# EAGLE design ArduinoShieldAdaptor-0BAC0805 (EAGLE 5.10)
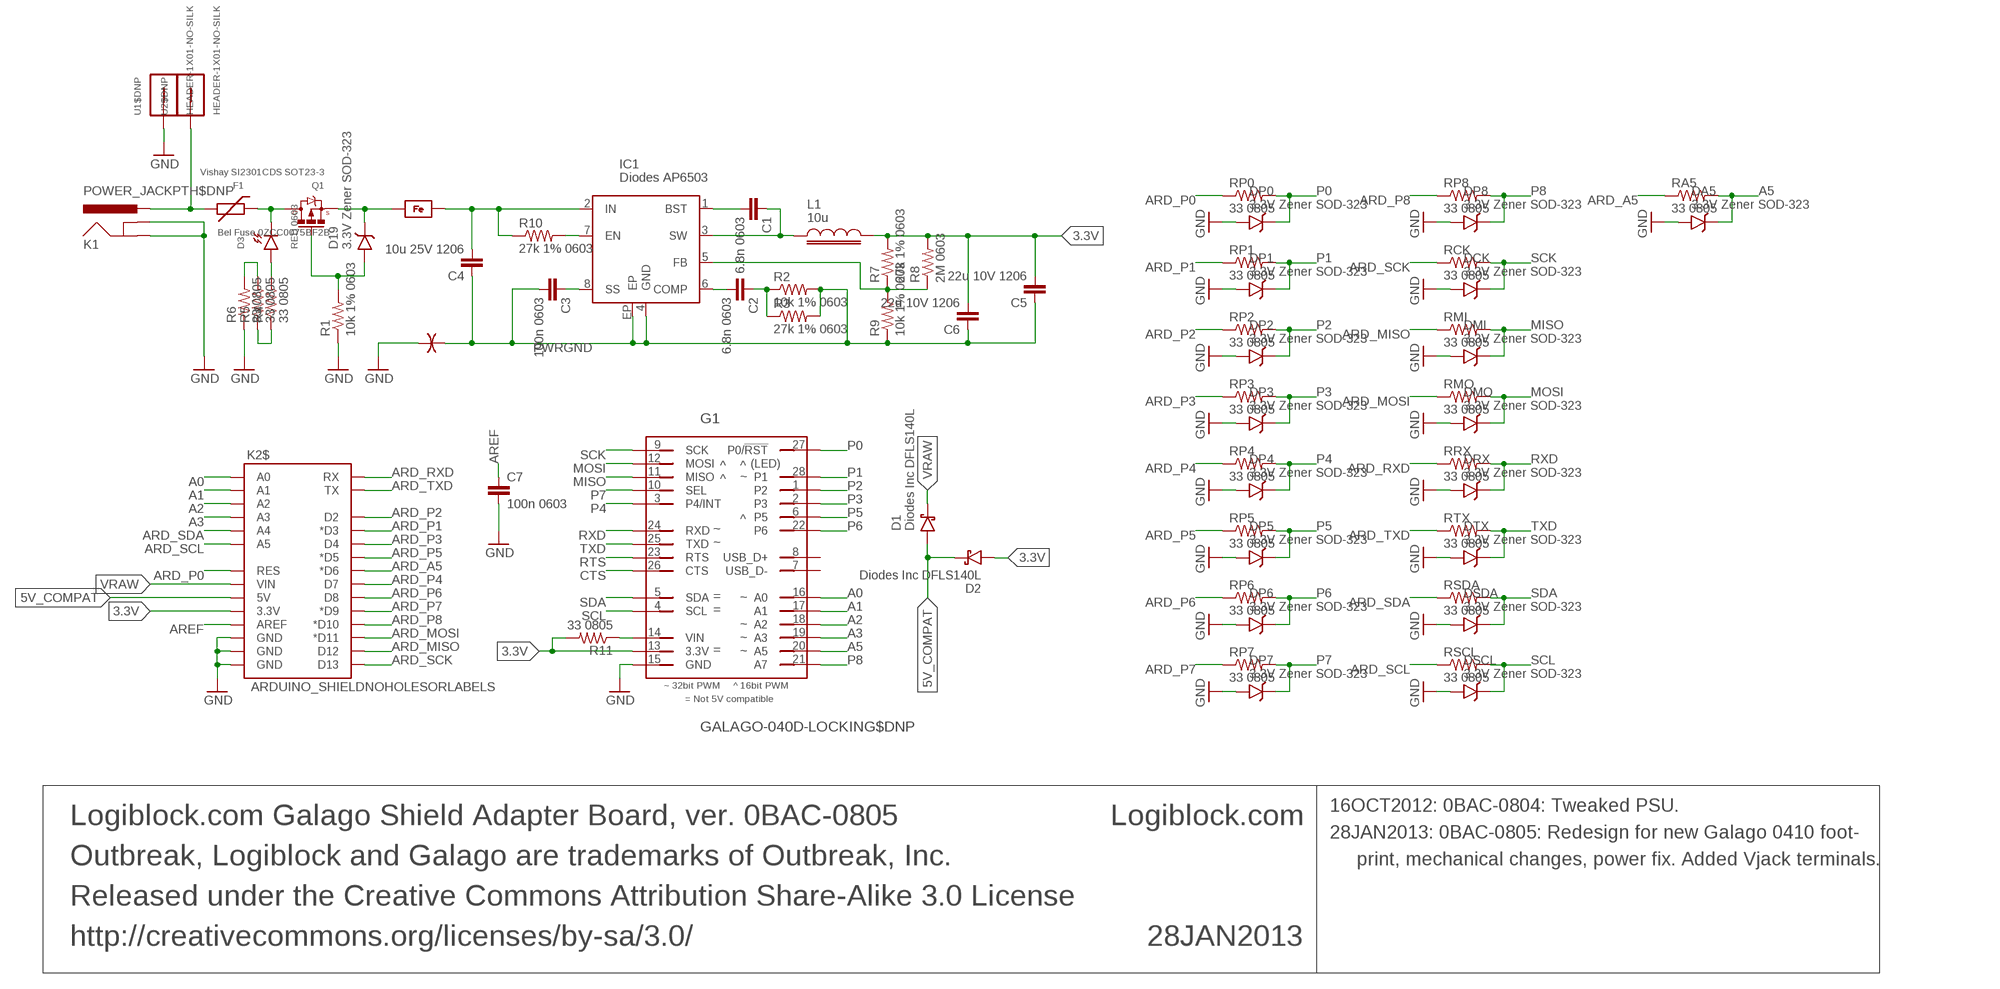
[diagram p0: schematic, sheet 1]

## Parts
28JAN2013  Logiblock.com Galago Shield Adapter Board, ver. 0BAC-0805  INFO-BLOCK  [INFO-BLOCK]
C1  6.8n 0603  CAP-0603  [0603]
C2  6.8n 0603  CAP-0603  [0603]
C3  100n 0603  CAP-0603  [0603]
C4  10u 25V 1206  CAP-1206  [1206]
C5  22u 10V 1206  CAP-1206  [1206]
C6  22u 10V 1206  CAP-1206  [1206]
C7  100n 0603  CAP-0603  [0603]
D1  Diodes Inc DFLS140L  DIODE-SCHOTTKY-POWERDI-123  [DIODE-SMT-POWERDI-123]
D2  Diodes Inc DFLS140L  DIODE-SCHOTTKY-POWERDI-123  [DIODE-SMT-POWERDI-123]
D3  RED 0603  LED-0603  [0603-DIODE]
D19  3.3V Zener SOD-323  DIODE-ZENER-SOD323  [SOD323]
DA5  3.3V Zener SOD-323  DIODE-ZENER-SOD323  [SOD323]
DCK  3.3V Zener SOD-323  DIODE-ZENER-SOD323  [SOD323]
DMI  3.3V Zener SOD-323  DIODE-ZENER-SOD323  [SOD323]
DMO  3.3V Zener SOD-323  DIODE-ZENER-SOD323  [SOD323]
DP0  3.3V Zener SOD-323  DIODE-ZENER-SOD323  [SOD323]
DP1  3.3V Zener SOD-323  DIODE-ZENER-SOD323  [SOD323]
DP2  3.3V Zener SOD-323  DIODE-ZENER-SOD323  [SOD323]
DP3  3.3V Zener SOD-323  DIODE-ZENER-SOD323  [SOD323]
DP4  3.3V Zener SOD-323  DIODE-ZENER-SOD323  [SOD323]
DP5  3.3V Zener SOD-323  DIODE-ZENER-SOD323  [SOD323]
DP6  3.3V Zener SOD-323  DIODE-ZENER-SOD323  [SOD323]
DP7  3.3V Zener SOD-323  DIODE-ZENER-SOD323  [SOD323]
DP8  3.3V Zener SOD-323  DIODE-ZENER-SOD323  [SOD323]
DRX  3.3V Zener SOD-323  DIODE-ZENER-SOD323  [SOD323]
DSCL  3.3V Zener SOD-323  DIODE-ZENER-SOD323  [SOD323]
DSDA  3.3V Zener SOD-323  DIODE-ZENER-SOD323  [SOD323]
DTX  3.3V Zener SOD-323  DIODE-ZENER-SOD323  [SOD323]
F1  Bel Fuse 0ZCC0075BF2B  PTC-1812-(4532-METRIC)  [1812-(4532-METRIC)-PTC]
FB1  3A 100@100MHz 0603  FERRITE-BEAD-0603  [0603]
G1  GALAGO-040D-LOCKING$DNP  GALAGO-040D-LOCKING  [GALAGO-LOCKING]
IC1  Diodes AP6503  SWITCHING-REGULATOR-VARIABLE-BUCK-DIODES-AP6503  [EIAJ-SOIC8-3.9MM-EXPOSED-PAD]
K1  POWER_JACKPTH$DNP  POWER_JACKPTH  [POWER_JACK_PTH]
K2$  ARDUINO_SHIELDNOHOLESORLABELS  [DUEMILANOVE_SHIELD_NOHOLES_NOLABELS]
L1  10u  INDUCTOR-6X6MM  [INDUCTOR-SMD-6X6MM]
Q1  Vishay SI2301CDS SOT23-3  MOSFET-P-CHANNEL-VISHAY-SI2301  [SOT23-3]
R1  10k 1% 0603  RESISTOR-0603  [0603]
R2  10k 1% 0603  RESISTOR-0603  [0603]
R3  27k 1% 0603  RESISTOR-0603  [0603]
R4  33 0805  RESISTOR-0805  [0805]
R5  33 0805  RESISTOR-0805  [0805]
R6  33 0805  RESISTOR-0805  [0805]
R7  27k 1% 0603  RESISTOR-0603  [0603]
R8  2M 0603  RESISTOR-0603  [0603]
R9  10k 1% 0603  RESISTOR-0603  [0603]
R10  27k 1% 0603  RESISTOR-0603  [0603]
R11  33 0805  RESISTOR-0805  [0805]
RA5  33 0805  RESISTOR-0805  [0805]
RCK  33 0805  RESISTOR-0805  [0805]
RMI  33 0805  RESISTOR-0805  [0805]
RMO  33 0805  RESISTOR-0805  [0805]
RP0  33 0805  RESISTOR-0805  [0805]
RP1  33 0805  RESISTOR-0805  [0805]
RP2  33 0805  RESISTOR-0805  [0805]
RP3  33 0805  RESISTOR-0805  [0805]
RP4  33 0805  RESISTOR-0805  [0805]
RP5  33 0805  RESISTOR-0805  [0805]
RP6  33 0805  RESISTOR-0805  [0805]
RP7  33 0805  RESISTOR-0805  [0805]
RP8  33 0805  RESISTOR-0805  [0805]
RRX  33 0805  RESISTOR-0805  [0805]
RSCL  33 0805  RESISTOR-0805  [0805]
RSDA  33 0805  RESISTOR-0805  [0805]
RTX  33 0805  RESISTOR-0805  [0805]
U1$  GND-ISOLATOR-0.032"  [GND-ISOLATOR-0.032"]
U1$DNP  HEADER-1X01-NO-SILK  [HEADER-1X01-NO-SILK]
U2$DNP  HEADER-1X01-NO-SILK  [HEADER-1X01-NO-SILK]

## Nets
3.3V: C5.1 C6.1 D2.SMALL(A) G1.13(3.3V) K2$.3.3V L1.2 R7.2 R8.2 R11.2
5V_COMPAT: D1.SMALL(A) D2.BIG(K) K2$.5V
A0: G1.16(A0) K2$.A0
A1: G1.17(A1) K2$.A1
A2: G1.18(A2) K2$.A2
A3: G1.19(A3) K2$.A3
A5: DA5.K G1.20(A5) RA5.2
ARD_A5: K2$.D6(*D6) RA5.1
ARD_MISO: K2$.D12 RMI.1
ARD_MOSI: K2$.D11(*D11) RMO.1
ARD_P0: K2$.RES RP0.1
ARD_P1: K2$.D3(*D3) RP1.1
ARD_P2: K2$.D2 RP2.1
ARD_P3: K2$.D4 RP3.1
ARD_P4: K2$.D7 RP4.1
ARD_P5: K2$.D5(*D5) RP5.1
ARD_P6: K2$.D8 RP6.1
ARD_P7: K2$.D9(*D9) RP7.1
ARD_P8: K2$.D10(*D10) RP8.1
ARD_RXD: K2$.RX RRX.1
ARD_SCK: K2$.D13 RCK.1
ARD_SCL: K2$.A5 RSCL.1
ARD_SDA: K2$.A4 RSDA.1
ARD_TXD: K2$.TX RTX.1
AREF: C7.2 K2$.AREF
CTS: G1.26(CTS)
GND: C7.1 DA5.A DCK.A DMI.A DMO.A DP0.A DP1.A DP2.A DP3.A DP4.A DP5.A DP6.A DP7.A DP8.A DRX.A DSCL.A DSDA.A DTX.A G1.15(GND) K1.GND K1.GNDBREAK K2$.GND@0(GND) K2$.GND@1(GND) K2$.GND@2(GND) R1.1 R6.1 U1$.A U1$DNP.1
MISO: DMI.K G1.11(MISO) RMI.2
MOSI: DMO.K G1.12(MOSI) RMO.2
N$1: IC1.7(EN) R10.2
N$2: IC1.5(FB) R7.1 R8.1 R9.2
N$4: C2.2 R2.1 R3.1
N$5: C2.1 IC1.6(COMP)
N$6: C1.1 IC1.1(BST)
N$7: C1.2 IC1.3(SW) L1.1
N$8: D19.A Q1.1(GATE) R1.2
N$12: C3.2 IC1.8(SS)
N$13: D3.1(A) R4.2
N$20: R4.1 R5.1
N$21: R5.2 R6.2
N$22: G1.14(VIN) R11.1
P0: DP0.K G1.27(P0/!RST) RP0.2
P1: DP1.K G1.28(P1) RP1.2
P2: DP2.K G1.1(P2) RP2.2
P3: DP3.K G1.2(P3) RP3.2
P4: DP4.K G1.3(P4/INT) RP4.2
P5: DP5.K G1.6(P5) RP5.2
P6: DP6.K G1.22(P6) RP6.2
P7: DP7.K G1.10(SEL) RP7.2
P8: DP8.K G1.21(A7) RP8.2
PWRGND: C3.1 C4.2 C5.2 C6.2 IC1.4(GND) IC1.EP R2.2 R3.2 R9.1 U1$.B
RTS: G1.23(RTS)
RXD: DRX.K G1.24(RXD) RRX.2
SCK: DCK.K G1.9(SCK) RCK.2
SCL: DSCL.K G1.4(SCL) RSCL.2
SDA: DSDA.K G1.5(SDA) RSDA.2
TXD: DTX.K G1.25(TXD) RTX.2
VIN: C4.1 FB1.2 IC1.2(IN) R10.1
VJACK: F1.1 K1.PWR U2$DNP.1
VJACK-FUSED: D3.2(K) F1.2 Q1.3(DRAIN)
VRAW: D1.BIG(K) D19.K FB1.1 K2$.VIN Q1.2(SOURCE)
Unconnected: G1.7(USB_D-) G1.8(USB_D+)

## Notes on the sheet
- 16OCT2012: 0BAC-0804: Tweaked PSU.
- 28JAN2013: 0BAC-0805: Redesign for new Galago 0410 foot-
- print, mechanical changes, power fix. Added Vjack terminals.

## Library data of the parts
28JAN2013 = Outbreak:INFO-BLOCK
C1-C7 = Outbreak:CAP
D1 D2 = Outbreak:DIODE-SCHOTTKY
D3 = Outbreak:LED
D19 DA5 DCK DMI DMO DP0 DP1-DP8 DRX DSCL DSDA DTX = Outbreak:DIODE-ZENER
F1 = Outbreak:PTC
FB1 = Outbreak:FERRITE-BEAD
G1 = Outbreak-v0:GALAGO-040D
IC1 = Outbreak:SWITCHING-REGULATOR-VARIABLE-BUCK-DIODES-AP6503
K1 = Outbreak:POWER_JACK: Power Jack This is the standard 5.5mm barrel jack for power. The PTH is the most common, proven, reliable, footprint. All others are experimental. The Slot footprint only works if the mill layer is transmitted to the PCB fab house so be warned. Spark Fun Electronics SKU : PRT-00119. Mating wall wart : TOL-00298 (and others)
K2$ = SparkFun:ARDUINO_SHIELD
L1 = Outbreak:INDUCTOR
Q1 = Outbreak:MOSFET-P-CHANNEL
R1-R11 RA5 RCK RMI RMO RP0 RP1-RP8 RRX RSCL RSDA RTX = Outbreak:RESISTOR: Resistor Basic schematic elements and footprints for 0603, 1206, and PTH resistors.
U1$ = Outbreak:GND-ISOLATOR
U1$DNP U2$DNP = Outbreak:HEADER-1X01

## Board
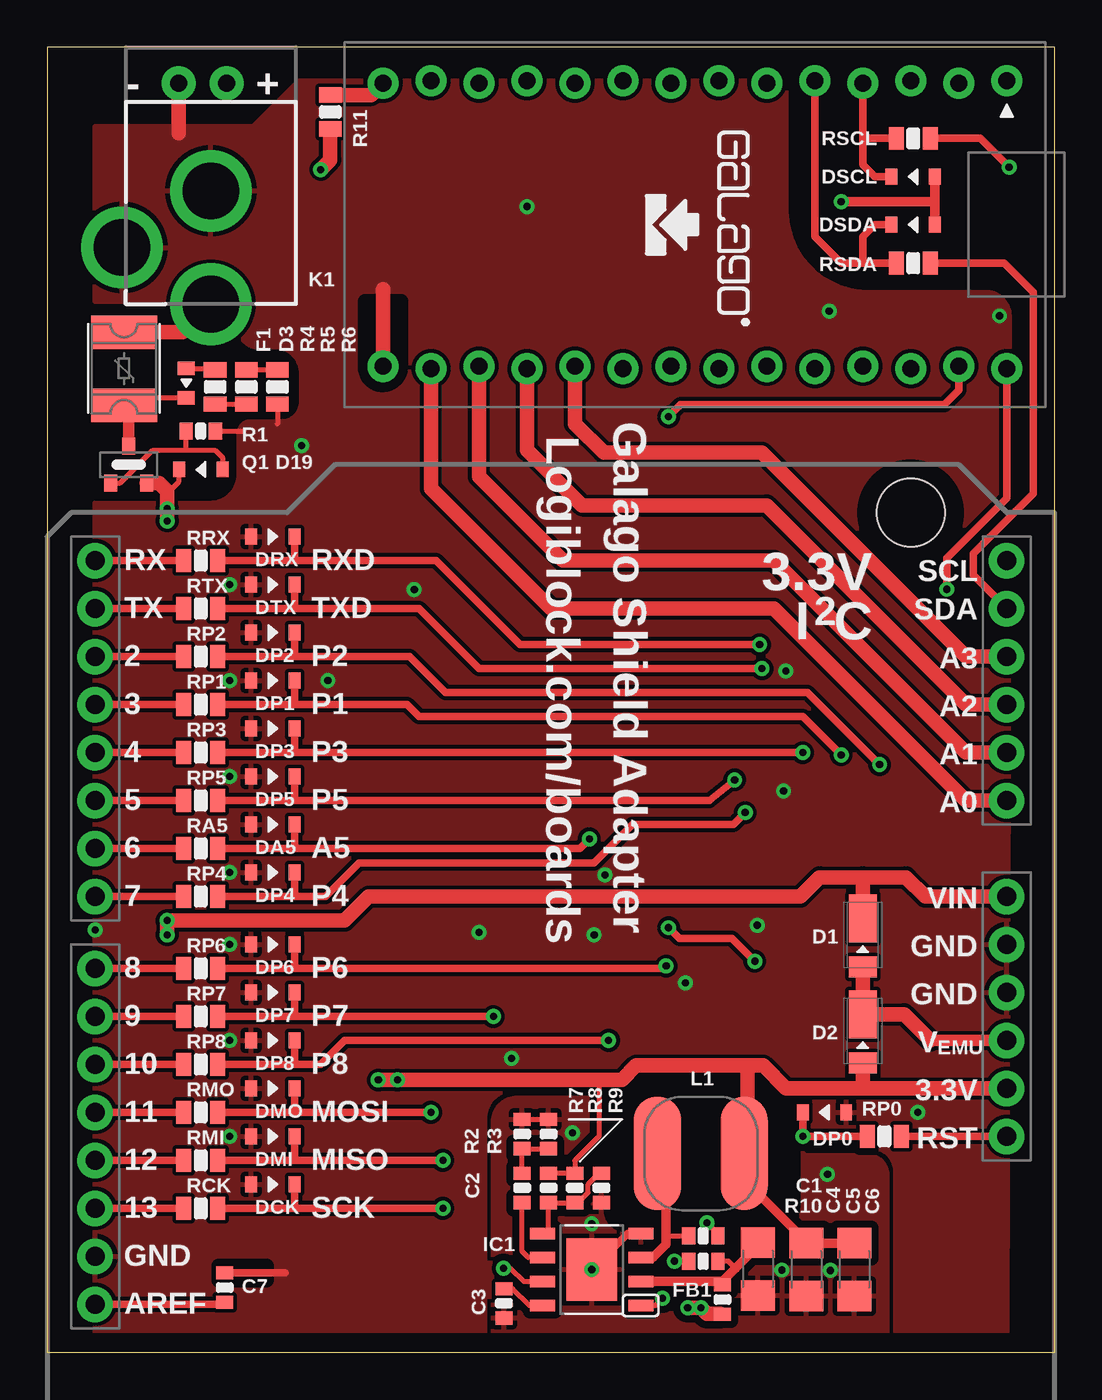
[diagram p1: board, top side]
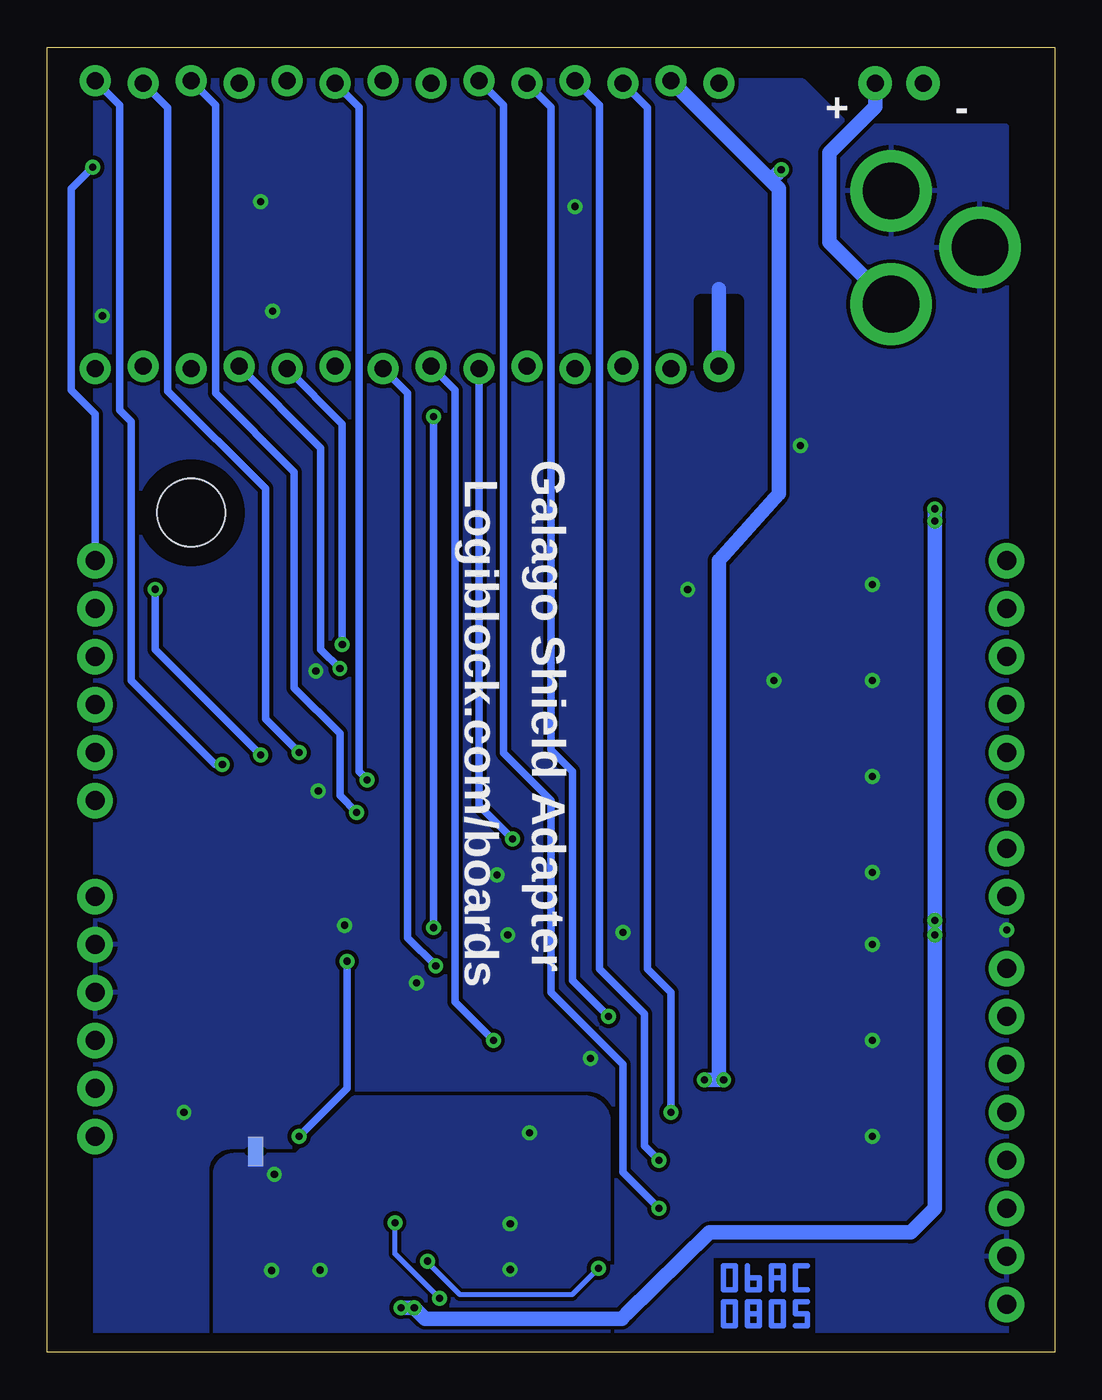
[diagram p2: board, bottom side, seen from below]

Size 53.34 x 69.09 mm. Coordinates in mm from the lower left corner, seen from the top.
Outline: 0,0 53.34,0 53.34,69.09 0,69.09 0,0
Copper layers (1*16): Top 0.035mm / dielectric 1.5mm / Bottom 0.035mm
Design rules "default *": minimum track width 10mil, minimum drill 15mil, track to track 8mil, track to pad 8mil, pad to pad 8mil, via to via 8mil, smd to smd 8mil, copper to edge 40mil, drill to drill 8mil, minimum pad ring 10mil, minimum via ring 8mil, stop-mask expansion 4mil, vias tented up to drill 20mil, thermal gap 10mil
Holes 3.61 mm at 45.72,44.45
tRestrict: area 30,6.9 to 39.4,13.5; area 9.1,3.8 to 11.6,4.6; area 16.8,51.2 to 18.7,55.7
bRestrict: area 16.8,51.2 to 18.7,55.7

### Footprints (pad centres in the part's own frame; a part is rotated, then mirrored left to right if it is on the bottom)
0603 = smd 0.7 x 0.9: 1 -0.777,0; 2 0.777,0
1206 = smd 1.6 x 1.8: 1 -1.4,0; 2 1.4,0
DIODE-SMT-POWERDI-123 = smd 2.52 x 1.5: BIG 0.87,0 | smd 1.1 x 1.5: SMALL -1.69,0
0603-DIODE = smd 0.7 x 0.9: 1 -0.777,0; 2 0.777,0
SOD323 = smd 0.63 x 0.83: A -1.15,0; K 1.15,0
1812-(4532-METRIC)-PTC = smd 1.78 x 3.5: 1 -1.922,0.002; 2 1.938,0.002
GALAGO-LOCKING = drill 0.9 pad 1.651 round: 1 -7.62,16.51; 2 -7.493,13.97; 3 -7.62,11.43; 4 -7.493,8.89; 5 -7.62,6.35; 6 -7.493,3.81; 7 -7.62,1.27; 8 -7.493,-1.27; 9 -7.62,-3.81; 10 -7.493,-6.35; 11 -7.62,-8.89; 12 -7.493,-11.43; 13 -7.62,-13.97; 14 -7.493,-16.51; 15 7.493,-16.51; 16 7.62,-13.97; 17 7.493,-11.43; 18 7.62,-8.89; 19 7.493,-6.35; 20 7.62,-3.81; 21 7.493,-1.27; 22 7.62,1.27; 23 7.493,3.81; 24 7.62,6.35; 25 7.493,8.89; 26 7.62,11.43; 27 7.493,13.97; 28 7.62,16.51
EIAJ-SOIC8-3.9MM-EXPOSED-PAD = smd 1.321 x 0.61: 1 -2.618,1.905; 2 -2.618,0.635; 3 -2.618,-0.635; 4 -2.618,-1.905; 5 2.618,-1.905; 6 2.618,-0.635; 7 2.618,0.635; 8 2.618,1.905 | smd 2.66 x 3.3: EP 0,0
POWER_JACK_PTH = drill 2.997 pad 4.318 round: GND 0,7.7; GNDBREAK 4.7,10.7; PWR 0,13.7
DUEMILANOVE_SHIELD_NOHOLES_NOLABELS = drill 1.016 pad 1.88 round: 3.3V 50.8,26.67; 5V 50.8,29.21; A0 50.8,41.91; A1 50.8,44.45; A2 50.8,46.99; A3 50.8,49.53; A4 50.8,52.07; A5 50.8,54.61; AREF 2.54,15.24; D2 2.54,49.53; D3 2.54,46.99; D4 2.54,44.45; D5 2.54,41.91; D6 2.54,39.37; D7 2.54,36.83; D8 2.54,33.02; D9 2.54,30.48; D10 2.54,27.94; D11 2.54,25.4; D12 2.54,22.86; D13 2.54,20.32; GND@0 50.8,31.75; GND@1 50.8,34.29; GND@2 2.54,17.78; RES 50.8,24.13; RX 2.54,54.61; TX 2.54,52.07; VIN 50.8,36.83
INDUCTOR-SMD-6X6MM = smd 2.5 x 6: 1 -2.3,0; 2 2.3,0
SOT23-3 = smd 0.7 x 0.9: 1 0.95,0.97; 2 -0.95,0.97; 3 0,-0.97
0805 = smd 0.8 x 1.2: 1 -0.9,0; 2 0.9,0
GND-ISOLATOR-0.032" = smd 0.813 x 0.813: A -0.381,0; B 0.381,0
HEADER-1X01-NO-SILK = drill 0.9 pad 1.778 round: 1 0,0

### Placement (x,y rotation side)
28JAN2013  5.4,-5.33 0 top  (outside the outline)
C1  34.73,6.16 180 top
C2  25.15,8.7 90 top
C3  24.18,2.59 90 top
C4  37.63,4.41 270 top
C5  40.2,4.38 270 top
C6  42.74,4.38 270 top
C7  9.4,3.43 270 top
D1  43.18,22.1 90 top
D2  43.18,17.02 90 top
D3  7.37,51.31 270 top
D19  8.13,46.74 180 top
DA5  11.94,27.94 0 top
DCK  11.94,8.89 0 top
DMI  11.94,11.43 0 top
DMO  11.94,13.97 0 top
DP0  41.15,12.7 180 top
DP1  11.94,35.56 0 top
DP2  11.94,38.1 0 top
DP3  11.94,33.02 0 top
DP4  11.94,25.4 0 top
DP5  11.94,30.48 0 top
DP6  11.94,21.59 0 top
DP7  11.94,19.05 0 top
DP8  11.94,16.51 0 top
DRX  11.94,43.18 0 top
DSCL  45.85,62.23 180 top
DSDA  45.85,59.69 180 top
DTX  11.94,40.64 0 top
F1  4.06,52.07 270 top
FB1  35.75,2.79 90 top
G1  34.29,59.69 270 top
IC1  28.83,4.38 180 top
K1  8.66,69.19 180 top
K2$  0,-12.7 0 top
L1  34.61,10.53 0 top
Q1  4.32,46.99 180 top
R1  8.13,48.77 180 top
R2  25.15,11.56 90 top
R3  26.54,11.56 90 top
R4  8.89,51.1 90 top
R5  10.54,51.1 90 top
R6  12.19,51.1 90 top
R7  26.54,8.7 90 top
R8  27.94,8.7 90 top
R9  29.34,8.7 90 top
R10  34.73,4.83 180 top
R11  14.99,65.66 270 top
RA5  8.13,26.67 0 top
RCK  8.13,7.62 0 top
RMI  8.13,10.16 0 top
RMO  8.13,12.7 0 top
RP0  44.32,11.43 180 top
RP1  8.13,34.29 0 top
RP2  8.13,36.83 0 top
RP3  8.13,31.75 0 top
RP4  8.13,24.13 0 top
RP5  8.13,29.21 0 top
RP6  8.13,20.32 0 top
RP7  8.13,17.78 0 top
RP8  8.13,15.24 0 top
RRX  8.13,41.91 0 top
RSCL  45.85,64.26 180 top
RSDA  45.85,57.66 180 top
RTX  8.13,39.37 0 top
U1$  42.3,10.63 270 bottom
U1$DNP  6.96,67.18 0 top
U2$DNP  9.5,67.18 0 top
U$2  [GALAGO-LOGO]  36.32,59.69 270 top
U$3  [GALAGO-APP-BOARD-SYMBOL]  32.51,59.69 270 top

### Tracks (layer width: path | path; a pad name or v marks a point on that pad's centre or on a via)
3.3V  (via drill 0.38)
  Top 0.254: R7.2 R8.2 27.94,10.16 29.21,11.43 29.21,14.41
  Top 0.508: C6.1 C5.1 39.69,5.78 39.69,6.35 36.91,9.13 L1.2
  Top 0.762: L1.2 37.08,10.71 37.08,15.18 | 37.08,15.18 37.91,15.18 39.12,13.97 43.18,13.97 | 43.18,13.97 K2$.3.3V | v17.53,14.41 v18.54,14.41 29.21,14.41 30.42,14.41 31.18,15.18 37.08,15.18 | 43.18,13.97 D2.SMALL | R11.2 14.99,63.12 v14.48,62.61
  Bottom 0.762: 17.78,14.41 17.78,41.91 14.61,45.47 14.61,61.59 15.05,62.04 | v17.53,14.41 17.78,14.41 | v18.54,14.41 17.78,14.41 | 15.05,62.04 G1.13 | 15.05,62.04 v14.48,62.61
5V_COMPAT
  Top 0.61: 46.76,16.51 K2$.5V
  Top 0.762: D1.SMALL D2.BIG 45.38,17.89 46.76,16.51
A0
  Top 0.762: K2$.A0 48.64,29.21 38.48,39.37 26.67,39.37 20.32,45.72 G1.16
A1
  Top 0.762: K2$.A1 48.64,31.75 38.48,41.91 27.3,41.91 22.86,46.35 G1.17
A2
  Top 0.762: K2$.A2 48.64,34.29 38.1,44.83 28.32,44.83 25.4,47.75 G1.18
A3
  Top 0.762: K2$.A3 48.64,36.83 37.85,47.62 29.46,47.62 27.94,49.15 G1.19
A5  (via drill 0.38)
  Top 0.406: RA5.2 13.09,26.67 | v28.7,27.18 28.19,26.67 13.09,26.67 | 13.09,26.67 DA5.K
  Bottom 0.406: v28.7,27.18 30.48,28.96 G1.20
ARD_A5
  Top 0.406: K2$.D6 RA5.1
ARD_MISO
  Top 0.406: K2$.D12 RMI.1
ARD_MOSI
  Top 0.406: K2$.D11 RMO.1
ARD_P0
  Top 0.406: RP0.1 K2$.RES
ARD_P1
  Top 0.406: K2$.D3 RP1.1
ARD_P2
  Top 0.406: K2$.D2 RP2.1
ARD_P3
  Top 0.406: K2$.D4 RP3.1
ARD_P4
  Top 0.406: K2$.D7 RP4.1
ARD_P5
  Top 0.406: K2$.D5 RP5.1
ARD_P6
  Top 0.406: K2$.D8 RP6.1
ARD_P7
  Top 0.406: K2$.D9 RP7.1
ARD_P8
  Top 0.406: K2$.D10 RP8.1
ARD_RXD
  Top 0.406: K2$.RX RRX.1
ARD_SCK
  Top 0.406: K2$.D13 RCK.1
ARD_SCL  (via drill 0.38)
  Top 0.406: RSCL.1 49.4,64.26 v50.93,62.74
  Bottom 0.406: K2$.A5 50.8,49.66 52.07,50.93 52.07,61.59 v50.93,62.74
ARD_SDA
  Top 0.406: K2$.A4 49.02,41.15 49.02,42.29 52.2,45.47 52.2,56.13 50.67,57.66 RSDA.1
ARD_TXD
  Top 0.406: K2$.TX RTX.1
AREF
  Top 0.406: K2$.AREF 8.89,2.54 C7.2
GND  (via drill 0.38)
  Top 0.254: R1.1 10.41,48.77 | R6.1 12.19,49.15
  Top 0.406: C7.1 12.59,4.21
  Top 0.508: v42.04,60.91 47,60.91 | 47,60.91 DSCL.A | 47,60.91 DSDA.A
  Top 0.762: 6.96,64.54 U1$DNP.1 | G1.15 17.78,56.29
  Bottom 0.762: G1.15 17.78,56.29
  other vias: 50.42,54.86 22.86,22.23 2.54,22.35 33.78,19.56 29.53,25.27 28.96,22.1 39.12,36.07 38.99,29.72 9.65,11.43 9.65,16.51 9.65,35.56 9.65,30.48 9.65,25.4 9.65,40.64 13.46,48.01 25.4,60.66 37.59,22.61 9.65,21.59 46.1,12.7 24.57,15.56 41.4,55.12 14.86,35.56 19.43,40.39
  pour Top (rank 2): 2.54,64.9 10.92,64.9 13.34,67.31 39.12,67.31 39.12,60.45 arc90 43.43,56.13 49.66,56.13 arc-90 50.93,54.86 50.8,0 2.54,0 2.54,44.96 8.64,44.96 arc90 10.16,46.48 10.16,48.64 arc-90 10.79,49.28 12.45,49.28 arc90 13.46,50.29 13.46,51.82 arc90 12.06,53.21 11.18,53.21 arc-90 10.16,54.23 10.16,55.63 2.54,55.63
  pour Bottom (rank 2): 2.54,64.9 10.92,64.9 13.34,67.31 50.8,67.31 50.8,0 18.16,0 18.16,5.14 12.57,5.14 12.57,0 2.54,0
MISO  (via drill 0.38)
  Top 0.406: RMI.2 13.09,10.16 | 13.09,10.16 DMI.K | 13.09,10.16 v20.95,10.16
  Bottom 0.406: v20.95,10.16 21.72,10.92 21.72,17.91 24.1,20.29 24.1,66.01 G1.11
MOSI  (via drill 0.38)
  Top 0.406: RMO.2 13.09,12.7 | 13.09,12.7 DMO.K | 13.09,12.7 v20.32,12.7
  Bottom 0.406: v20.32,12.7 20.32,19.05 21.56,20.29 21.56,65.88 G1.12
N$1  (via drill 0.38)
  Top 0.254: IC1.7 25.23,3.75 24.54,4.45 v24.16,4.45 | v33.21,4.83 R10.2
  Bottom 0.254: v24.16,4.45 25.55,3.05 31.5,3.05 33.21,4.76 v33.21,4.83
N$2
  Top 0.254: R9.2 29.23,9.48 28.64,8.89 28.64,8.45 28.12,7.92 R8.1 R7.1 26.54,6.29 IC1.5
N$4
  Top 0.254: C2.2 R2.1 R3.1
N$5
  Top 0.254: IC1.6 25.46,5.02 25.15,5.33 C2.1
N$6  (via drill 0.38)
  Top 0.254: IC1.1 32.19,2.48 v32.58,2.86 | C1.1 35.51,6.27 v34.92,6.86
  Bottom 0.254: v32.58,2.86 34.92,5.21 v34.92,6.86
N$7
  Top 0.254: C1.2 32.77,6.16 32.77,6.1
  Top 0.508: L1.1 32.77,10.53 32.77,6.1 32.77,5.71 32.07,5.02 IC1.3
N$8
  Top 0.254: Q1.1 3.86,46.02 5.59,47.75 7.37,47.75 | 7.37,47.75 8.89,47.75 9.28,47.36 D19.A | R1.2 7.37,48.77 7.37,47.75
N$9
  Bottom 0.282: 17.53,4.57 16.89,4.57 16.89,3.3 17.53,3.3 17.53,4.57
N$10
  Bottom 0.282: 16.26,3.94 16.26,4.57 | 16.26,3.94 16.26,3.3 15.62,3.3 15.62,3.94 16.26,3.94
N$11
  Bottom 0.282: 14.35,3.94 14.35,4.57 14.99,4.57 14.99,3.3 | 14.35,3.94 14.35,3.3 | 14.35,3.94 14.99,3.94
N$12
  Top 0.254: IC1.8 25.53,2.48 24.64,3.37 C3.2
N$13
  Top 0.254: D3.1 8.89,52.09 R4.2
N$15
  Bottom 0.282: 13.08,3.3 13.72,3.3 13.72,4.57 13.08,4.57
N$16
  Bottom 0.282: 17.53,2.67 16.89,2.67 16.89,1.4 17.53,1.4 17.53,2.67
N$17
  Bottom 0.282: 16.26,2.03 16.26,2.67 15.62,2.67 15.62,2.03 | 16.26,2.03 16.26,1.4 15.62,1.4 15.62,2.03 | 15.62,2.03 16.26,2.03
N$18
  Bottom 0.282: 14.99,2.67 14.35,2.67 14.35,1.4 14.99,1.4 14.99,2.67
N$19
  Bottom 0.282: 13.08,2.67 13.72,2.67 13.72,2.03 13.08,2.03 13.08,1.4 13.72,1.4
N$20
  Top 0.254: R4.1 R5.1
N$21
  Top 0.254: R6.2 R5.2
N$22
  Top 0.762: R11.1 17.16,66.56 G1.14
P0  (via drill 0.38)
  Top 0.406: v37.47,20.7 36.26,21.91 33.47,21.91 v32.89,22.48 | RP0.2 v40.01,11.43 40,11.43 DP0.K | v32.89,49.53 33.53,50.16 47.5,50.16 48.26,50.93 G1.27
  Bottom 0.406: v37.47,20.7 37.47,13.97 v40.01,11.43 | v32.89,22.48 v32.89,49.53
P1  (via drill 0.38)
  Top 0.406: v42.04,31.62 40.01,33.66 19.68,33.66 19.05,34.29 13.09,34.29 | v47.62,40.39 47.62,42.04 50.8,45.21 G1.28 | RP1.2 13.09,34.29 | 13.09,34.29 DP1.K
  Bottom 0.406: v42.04,31.62 47.62,37.21 v47.62,40.39
P2  (via drill 0.38)
  Top 0.406: v44.07,31.11 40.26,34.92 21.08,34.92 19.18,36.83 13.09,36.83 | RP2.2 13.09,36.83 | 13.09,36.83 DP2.K
  Bottom 0.406: v44.07,31.11 44.45,31.11 48.9,35.56 48.9,49.28 49.5,49.88 49.5,66.01 G1.1
P3  (via drill 0.38)
  Top 0.406: RP3.2 13.09,31.75 | 13.09,31.75 DP3.K | 13.09,31.75 v40.01,31.75
  Bottom 0.406: v40.01,31.75 41.78,33.53 41.78,45.72 46.96,50.9 46.96,65.88 G1.2
P4  (via drill 0.38)
  Top 0.406: v36.96,28.57 36.32,27.94 30.99,27.94 28.96,25.91 16.51,25.91 14.73,24.13 13.09,24.13 | RP4.2 13.09,24.13 | 13.09,24.13 DP4.K
  Bottom 0.406: v36.96,28.57 37.85,29.46 37.85,32.77 40.26,35.18 40.26,46.61 44.42,50.77 44.42,66.01 G1.3
P5  (via drill 0.38)
  Top 0.406: RP5.2 13.09,29.21 | v36.4,30.3 35.05,29.21 13.09,29.21 | 13.09,29.21 DP5.K
  Bottom 0.406: v36.4,30.3 36.83,30.73 36.83,65.91 G1.6
P6  (via drill 0.38)
  Top 0.406: RP6.2 13.09,20.32 | 13.09,20.32 DP6.K | 13.09,20.32 32.64,20.32 v32.77,20.45
  Bottom 0.406: v32.77,20.45 34.26,21.94 34.26,50.77 G1.22
P7  (via drill 0.38)
  Top 0.406: RP7.2 13.09,17.78 | 13.09,17.78 DP7.K | 13.09,17.78 v23.62,17.78
  Bottom 0.406: G1.10 26.67,65.91 26.67,31.88 25.53,30.73 25.53,19.68 v23.62,17.78
P8  (via drill 0.38)
  Top 0.406: RP8.2 13.09,15.24 | 13.09,15.24 DP8.K | 13.09,15.24 14.48,15.24 15.75,16.51 v29.72,16.51
  Bottom 0.406: G1.21 31.75,50.93 31.75,18.54 v29.72,16.51
PWRGND  (via drill 0.38)
  Top 0.254: R2.2 R3.2
  Top 0.406: IC1.4 30.73,6.29 IC1.EP
  other vias: 28.83,4.38 28.83,6.79 41.31,9.42 38.9,4.36 41.47,4.33 27.81,11.62
  pour Bottom: 23.62,12.19 arc-90 24.89,13.46 37.08,13.46 40.13,10.41 43.43,10.41 arc-90 44.45,9.4 44.45,0 23.62,0
  pour Top (isolate 0.381): 24.89,13.46 38.1,13.46 39.12,12.45 39.12,11.43 40.13,10.41 43.43,10.41 arc-90 44.45,9.4 44.45,0 23.62,0 23.62,12.19 arc-90
RXD  (via drill 0.38)
  Top 0.406: v37.72,37.47 25.02,37.47 20.57,41.91 13.09,41.91 | RRX.2 13.09,41.91 | 13.09,41.91 DRX.K
  Bottom 0.406: v37.72,37.47 37.72,49.15 G1.24
SCK  (via drill 0.38)
  Top 0.406: RCK.2 13.09,7.62 | 13.09,7.62 DCK.K | 13.09,7.62 v20.95,7.62
  Bottom 0.406: v20.95,7.62 22.86,9.53 22.86,15.24 26.67,19.05 26.67,29.21 29.18,31.72 29.18,66.01 G1.9
SCL
  Top 0.406: DSCL.K 43.81,62.23 43.18,62.87 43.18,64.26 | 43.18,64.26 G1.4 | 43.18,64.26 RSCL.2
SDA
  Top 0.406: 43.18,57.66 42.04,57.66 40.64,59.05 G1.5 | 43.18,57.66 RSDA.2 | DSDA.K 43.81,59.69 43.18,59.05 43.18,57.66
TXD  (via drill 0.38)
  Top 0.406: v37.85,36.2 22.86,36.2 19.68,39.37 13.09,39.37 | RTX.2 13.09,39.37 | 13.09,39.37 DTX.K
  Bottom 0.406: v37.85,36.2 38.86,37.21 38.86,47.88 G1.25
VIN
  Top 0.254: 35.56,3.75 35.64,3.75 | R10.1 36.07,4.83 36.45,4.45
  Top 0.508: IC1.2 35.56,3.75 35.81,3.75 FB1.2 35.81,3.81 36.45,4.45 37.63,5.63 C4.1
VJACK
  Top 0.762: F1.1 7.16,53.99 K1.PWR
  Bottom 0.762: K1.PWR 11.94,58.77 11.94,63.5 9.5,65.94 U2$DNP.1
VJACK-FUSED
  Top 0.254: D3.2 4.32,50.53 F1.2
  Top 0.61: Q1.3 4.32,50.12 F1.2
VRAW  (via drill 0.38)
  Top 0.254: D19.K 6.98,46.09 6.48,45.59 6.35,45.59
  Top 0.508: 35.64,2.03 FB1.1
  Top 0.762: 43.18,25.15 40.89,25.15 39.88,24.13 17.02,24.13 15.75,22.86 v6.35,22.86 v6.35,22.1 | 43.18,25.15 45.47,25.15 46.48,24.13 K2$.VIN | 43.18,25.15 D1.BIG | v6.35,44.01 v6.35,44.65 6.35,45.59 5.92,46.02 Q1.2 | 35.64,2.03 34.94,2.03 v34.61,2.36 v33.91,2.36
  Bottom 0.762: v6.35,44.65 v6.35,22.86 6.35,7.62 7.62,6.35 18.29,6.35 22.67,2.03 22.92,1.78 33.33,1.78 v33.91,2.36 v34.61,2.36

### Text on the board
tPlace: - | + | Logiblock.com/boards | Galago Shield Adapter | 3.3V | SCL | RX | RXD | I | 2 | C | SDA | TX | TXD | A3 | 2 | P2 | A2 | 3 | P1 | A1 | 4 | P3 | A0 | 5 | P5 | 6 | A5 | VIN | 7 | P4 | GND | 8 | P6 | GND | 9 | P7 | V | EMU | 10 | P8 | 3.3V | 11 | MOSI | RST | 12 | MISO | 13 | SCK | GND | AREF
bPlace: - | + | Galago Shield Adapter | Logiblock.com/boards
tTest: Logiblock.com Galago Shield Adapter Board | 0BAC-0805 (Top Side) | (DNP AT FACTORY)